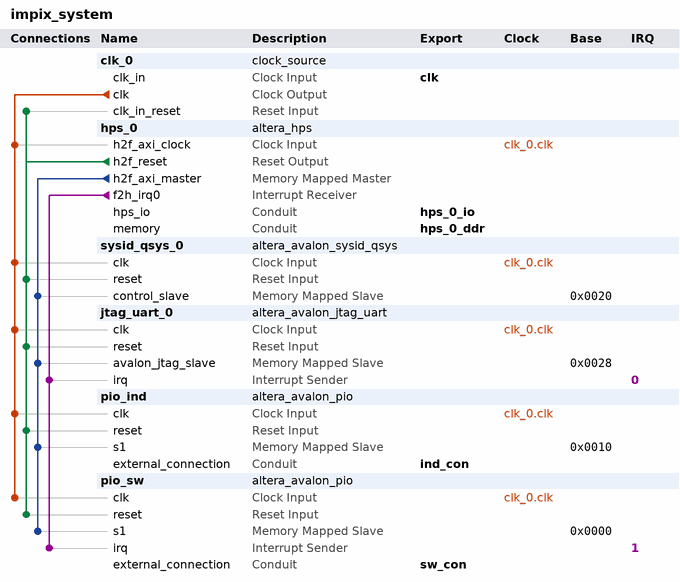
[diagram p0: system contents]
# Platform Designer (Qsys) system impix_system, Cyclone V 5CSEMA5F31C6
# Parameters at their usual value, and those the tool derives, are not listed.
package require -exact qsys 16.1
create_system impix_system
set_project_property DEVICE_FAMILY {Cyclone V}
set_project_property DEVICE 5CSEMA5F31C6

add_instance clk_0 clock_source 16.1
set_instance_parameter_value clk_0 clockFrequency 50000000

add_instance hps_0 altera_hps 16.1
set_instance_parameter_value hps_0 EMAC1_Mode RGMII
set_instance_parameter_value hps_0 EMAC1_PinMuxing {HPS I/O Set 0}
set_instance_parameter_value hps_0 F2SCLK_COLDRST_Enable false
set_instance_parameter_value hps_0 F2SCLK_DBGRST_Enable false
set_instance_parameter_value hps_0 F2SCLK_WARMRST_Enable false
set_instance_parameter_value hps_0 F2SINTERRUPT_Enable true
set_instance_parameter_value hps_0 F2S_Width 0
set_instance_parameter_value hps_0 FPGA_PERIPHERAL_OUTPUT_CLOCK_FREQ_EMAC0_GTX_CLK 125
set_instance_parameter_value hps_0 FPGA_PERIPHERAL_OUTPUT_CLOCK_FREQ_EMAC0_MD_CLK 2.5
set_instance_parameter_value hps_0 FPGA_PERIPHERAL_OUTPUT_CLOCK_FREQ_EMAC1_GTX_CLK 125
set_instance_parameter_value hps_0 FPGA_PERIPHERAL_OUTPUT_CLOCK_FREQ_EMAC1_MD_CLK 2.5
set_instance_parameter_value hps_0 HPS_PROTOCOL DDR3
set_instance_parameter_value hps_0 I2C0_Mode I2C
set_instance_parameter_value hps_0 I2C0_PinMuxing {HPS I/O Set 0}
set_instance_parameter_value hps_0 I2C1_Mode I2C
set_instance_parameter_value hps_0 I2C1_PinMuxing {HPS I/O Set 0}
set_instance_parameter_value hps_0 LWH2F_Enable false
set_instance_parameter_value hps_0 MEM_BANKADDR_WIDTH 3
set_instance_parameter_value hps_0 MEM_CLK_FREQ 400.0
set_instance_parameter_value hps_0 MEM_COL_ADDR_WIDTH 10
set_instance_parameter_value hps_0 MEM_DQ_WIDTH 32
set_instance_parameter_value hps_0 MEM_DRV_STR RZQ/6
set_instance_parameter_value hps_0 MEM_ROW_ADDR_WIDTH 15
set_instance_parameter_value hps_0 MEM_RTT_NOM RZQ/6
set_instance_parameter_value hps_0 MEM_RTT_WR {Dynamic ODT off}
set_instance_parameter_value hps_0 MEM_TCL 7
set_instance_parameter_value hps_0 MEM_TFAW_NS 45.0
set_instance_parameter_value hps_0 MEM_TRAS_NS 36.0
set_instance_parameter_value hps_0 MEM_TRCD_NS 13.125
set_instance_parameter_value hps_0 MEM_TRFC_NS 300.0
set_instance_parameter_value hps_0 MEM_TRP_NS 13.125
set_instance_parameter_value hps_0 MEM_VENDOR Other
set_instance_parameter_value hps_0 MEM_WTCL 7
set_instance_parameter_value hps_0 QSPI_Mode {1 SS}
set_instance_parameter_value hps_0 QSPI_PinMuxing {HPS I/O Set 0}
set_instance_parameter_value hps_0 REF_CLK_FREQ 25.0
set_instance_parameter_value hps_0 S2FCLK_USER2CLK 5
set_instance_parameter_value hps_0 S2F_Width 2
set_instance_parameter_value hps_0 SDIO_Mode {4-bit Data}
set_instance_parameter_value hps_0 SDIO_PinMuxing {HPS I/O Set 0}
set_instance_parameter_value hps_0 SPIM1_Mode {Single Slave Select}
set_instance_parameter_value hps_0 SPIM1_PinMuxing {HPS I/O Set 0}
set_instance_parameter_value hps_0 STM_Enable false
set_instance_parameter_value hps_0 TIMING_BOARD_AC_SKEW 0.02
set_instance_parameter_value hps_0 TIMING_BOARD_AC_TO_CK_SKEW 0.01
set_instance_parameter_value hps_0 TIMING_BOARD_DQ_TO_DQS_SKEW 0.05
set_instance_parameter_value hps_0 TIMING_BOARD_MAX_CK_DELAY 0.03
set_instance_parameter_value hps_0 TIMING_BOARD_MAX_DQS_DELAY 0.02
set_instance_parameter_value hps_0 TIMING_BOARD_SKEW_BETWEEN_DQS 0.06
set_instance_parameter_value hps_0 TIMING_BOARD_SKEW_CKDQS_DIMM_MAX 0.12
set_instance_parameter_value hps_0 TIMING_BOARD_SKEW_CKDQS_DIMM_MIN 0.06
set_instance_parameter_value hps_0 TIMING_BOARD_SKEW_WITHIN_DQS 0.01
set_instance_parameter_value hps_0 TIMING_TDH 65
set_instance_parameter_value hps_0 TIMING_TDQSCK 255
set_instance_parameter_value hps_0 TIMING_TDQSQ 125
set_instance_parameter_value hps_0 TIMING_TDS 30
set_instance_parameter_value hps_0 TIMING_TIH 140
set_instance_parameter_value hps_0 TIMING_TIS 190
set_instance_parameter_value hps_0 TIMING_TQSH 0.4
set_instance_parameter_value hps_0 UART0_Mode {No Flow Control}
set_instance_parameter_value hps_0 UART0_PinMuxing {HPS I/O Set 0}
set_instance_parameter_value hps_0 USB1_Mode SDR
set_instance_parameter_value hps_0 USB1_PinMuxing {HPS I/O Set 0}
set_instance_parameter_value hps_0 desired_cfg_clk_mhz 100.0
set_instance_parameter_value hps_0 desired_qspi_clk_mhz 400.0
set_instance_parameter_value hps_0 use_default_mpu_clk false

add_instance sysid_qsys_0 altera_avalon_sysid_qsys 16.1
set_instance_parameter_value sysid_qsys_0 id 0

add_instance jtag_uart_0 altera_avalon_jtag_uart 16.1
set_instance_parameter_value jtag_uart_0 simInteractiveOptions NO_INTERACTIVE_WINDOWS

add_instance pio_ind altera_avalon_pio 16.1
set_instance_parameter_value pio_ind direction Output
set_instance_parameter_value pio_ind width 4

add_instance pio_sw altera_avalon_pio 16.1
set_instance_parameter_value pio_sw captureEdge true
set_instance_parameter_value pio_sw direction Input
set_instance_parameter_value pio_sw edgeType ANY
set_instance_parameter_value pio_sw generateIRQ true
set_instance_parameter_value pio_sw irqType EDGE
set_instance_parameter_value pio_sw width 4

# connections
add_connection clk_0.clk hps_0.h2f_axi_clock clock
add_connection clk_0.clk jtag_uart_0.clk clock
add_connection clk_0.clk pio_ind.clk clock
add_connection clk_0.clk pio_sw.clk clock
add_connection clk_0.clk sysid_qsys_0.clk clock
add_connection hps_0.h2f_reset clk_0.clk_in_reset reset
add_connection hps_0.h2f_reset jtag_uart_0.reset reset
add_connection hps_0.h2f_reset pio_ind.reset reset
add_connection hps_0.h2f_reset pio_sw.reset reset
add_connection hps_0.h2f_reset sysid_qsys_0.reset reset
add_connection hps_0.h2f_axi_master jtag_uart_0.avalon_jtag_slave avalon
set_connection_parameter_value hps_0.h2f_axi_master/jtag_uart_0.avalon_jtag_slave baseAddress 0x0028
add_connection hps_0.h2f_axi_master pio_ind.s1 avalon
set_connection_parameter_value hps_0.h2f_axi_master/pio_ind.s1 baseAddress 0x0010
add_connection hps_0.h2f_axi_master pio_sw.s1 avalon
set_connection_parameter_value hps_0.h2f_axi_master/pio_sw.s1 baseAddress 0x0000
add_connection hps_0.h2f_axi_master sysid_qsys_0.control_slave avalon
set_connection_parameter_value hps_0.h2f_axi_master/sysid_qsys_0.control_slave baseAddress 0x0020
add_connection hps_0.f2h_irq0 jtag_uart_0.irq interrupt
set_connection_parameter_value hps_0.f2h_irq0/jtag_uart_0.irq irqNumber 0
add_connection hps_0.f2h_irq0 pio_sw.irq interrupt
set_connection_parameter_value hps_0.f2h_irq0/pio_sw.irq irqNumber 1

# exported interfaces
add_interface clk clock sink
set_interface_property clk EXPORT_OF clk_0.clk_in
add_interface hps_0_ddr conduit end
set_interface_property hps_0_ddr EXPORT_OF hps_0.memory
add_interface hps_0_io conduit end
set_interface_property hps_0_io EXPORT_OF hps_0.hps_io
add_interface ind_con conduit end
set_interface_property ind_con EXPORT_OF pio_ind.external_connection
add_interface sw_con conduit end
set_interface_property sw_con EXPORT_OF pio_sw.external_connection

set_interconnect_requirement {$system} qsys_mm.clockCrossingAdapter HANDSHAKE
set_interconnect_requirement {$system} qsys_mm.enableEccProtection FALSE
set_interconnect_requirement {$system} qsys_mm.insertDefaultSlave FALSE
set_interconnect_requirement {$system} qsys_mm.maxAdditionalLatency 1

save_system impix_system.qsys
